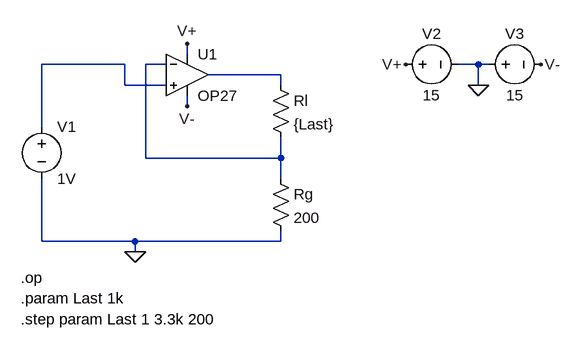
[diagram p0: schematic 01 Stromquelle mit NIV.asc]
01 Stromquelle mit NIV.asc, the LTspice schematic file:
Version 4
SHEET 1 880 680
WIRE 160 -128 160 -144
WIRE 64 -112 -64 -112
WIRE 128 -112 96 -112
WIRE 608 -112 576 -112
WIRE 624 -112 608 -112
WIRE 304 -96 192 -96
WIRE 64 -80 64 -112
WIRE 128 -80 64 -80
WIRE 304 -80 304 -96
WIRE 608 -80 608 -112
WIRE 160 -48 160 -64
WIRE -64 -16 -64 -112
WIRE 96 32 96 -112
WIRE 304 32 304 0
WIRE 304 32 96 32
WIRE 304 64 304 32
WIRE -64 160 -64 64
WIRE 80 160 -64 160
WIRE 304 160 304 144
WIRE 304 160 80 160
WIRE 80 176 80 160
FLAG 80 176 0
FLAG 608 -80 0
FLAG 496 -112 V+
FLAG 160 -144 V+
FLAG 160 -48 V-
FLAG 704 -112 V-
SYMBOL res 288 48 R0
SYMATTR InstName Rg
SYMATTR Value 200
SYMBOL res 288 -96 R0
SYMATTR InstName Rl
SYMATTR Value {Last}
SYMBOL OpAmps\\OP27 160 -160 R0
SYMATTR InstName U1
SYMBOL voltage -64 -32 R0
WINDOW 123 0 0 Left 0
WINDOW 39 0 0 Left 0
SYMATTR InstName V1
SYMATTR Value 1V
SYMBOL voltage 480 -112 R270
WINDOW 0 32 56 VTop 2
WINDOW 3 -32 56 VBottom 2
WINDOW 123 0 0 Left 0
WINDOW 39 0 0 Left 0
SYMATTR InstName V2
SYMATTR Value 15
SYMBOL voltage 608 -112 R270
WINDOW 0 32 56 VTop 2
WINDOW 3 -32 56 VBottom 2
WINDOW 123 0 0 Left 0
WINDOW 39 0 0 Left 0
SYMATTR InstName V3
SYMATTR Value 15
TEXT -96 248 Left 2 !.param Last 1k
TEXT -96 280 Left 2 !.step param Last 1 3.3k 200
TEXT -96 216 Left 2 !.op

The netlist it stands for:
* 01 Stromquelle mit NIV.asc
Rg N002 0 200
Rl N003 N002 {Last}
XU1 N001 N002 V+ V- N003 OP27  ; pins In+ In- V+ V- OUT
V1 N001 0 1V
V2 V+ 0 15
V3 0 V- 15
.param Last 1k
.step param Last 1 3.3k 200
.op
.lib ADI.lib
.backanno
.end